# EAGLE design nano (EAGLE 7.6.0)
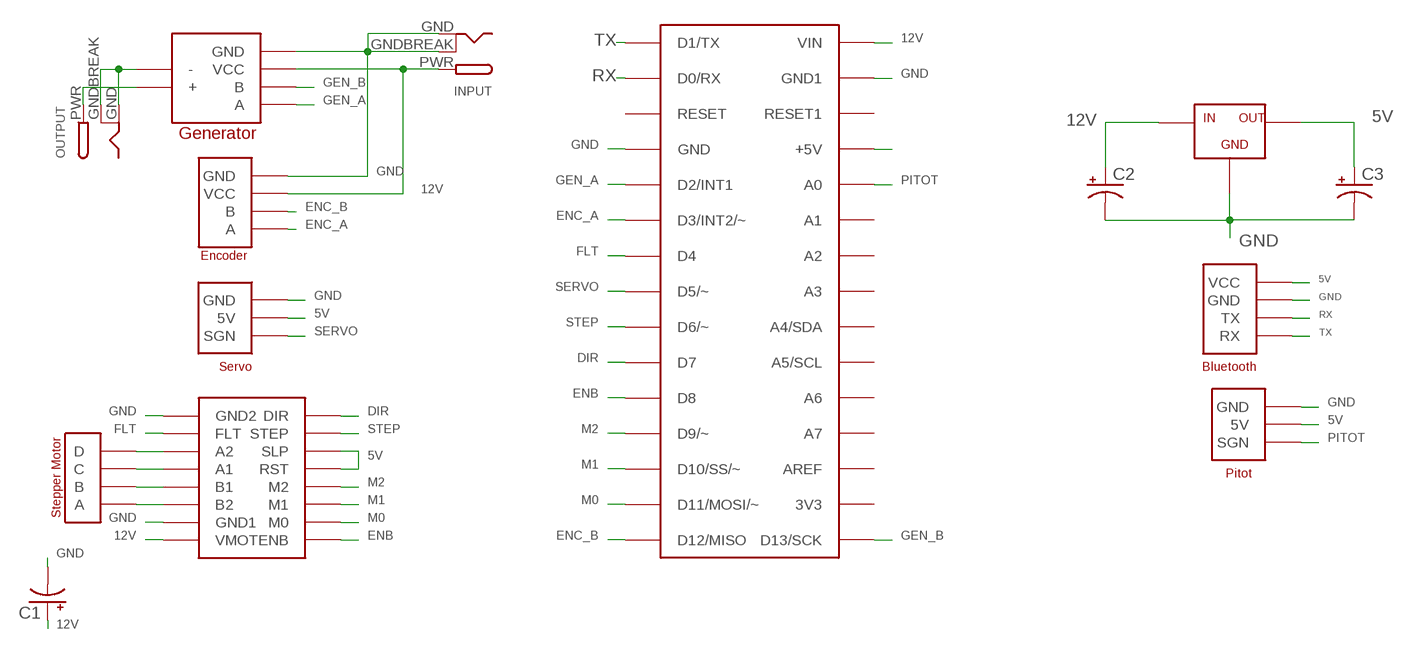
[diagram p0: schematic, sheet 1]

## Parts
C1  100UF-25V-20%(PTH)  [CPOL-RADIAL-100UF-25V]
C2  100UF-25V-20%(PTH)  [CPOL-RADIAL-100UF-25V]
C3  100UF-25V-20%(PTH)  [CPOL-RADIAL-100UF-25V]
INPUT  DCBARRELPTH  [DCJACK_2MM_PTH]
NANO  ARDUINONANO  [PDIP-32]
OUTPUT  DCBARRELPTH  [DCJACK_2MM_PTH]
U$1  HC06  [HC06]
U$2  ENCODER  [ENCODER]
U$3  PITOT  [PITOT]
U$4  STEPPER  [STEPPER]
U$5  STEPPER_DRIVER  [STEPPER_DRIVER]
U$6  SERVO  [SERVO]
U$7  GENERATOR  [GENERATOR]
U$8  7805  [7805]

## Nets
5V: C3.1(+) NANO.+5V U$1.VCC U$3.5V U$5.RST U$5.SLP U$6.5V U$8.OUT
12V: C1.1(+) C2.1(+) INPUT.PWR NANO.VIN U$2.VCC U$5.VMOT U$7.VCC U$8.IN
DIR: NANO.D7 U$5.DIR
ENB: NANO.D8 U$5.ENB
ENC_A: NANO.D3(D3/INT2/~) U$2.A
ENC_B: NANO.D12(D12/MISO) U$2.B
FLT: NANO.D4 U$5.FLT
GEN_A: NANO.D2(D2/INT1) U$7.A
GEN_B: NANO.D13(D13/SCK) U$7.B
GND: C1.2(-) C2.2(-) C3.2(-) INPUT.GND INPUT.GNDBREAK NANO.GND NANO.GND1 OUTPUT.GND OUTPUT.GNDBREAK U$1.GND U$2.GND U$3.GND U$5.GND1(GND2) U$5.GND(GND1) U$6.GND U$7.- U$7.GND U$8.GND
M0: NANO.D11(D11/MOSI/~) U$5.M0
M1: NANO.D10(D10/SS/~) U$5.M1
M2: NANO.D9(D9/~) U$5.M2
N$1: U$4.D U$5.A2
N$2: U$4.C U$5.A1
N$3: U$4.B U$5.B1
N$4: U$4.A U$5.B2
N$7: OUTPUT.PWR U$7.+
PITOT: NANO.A0 U$3.SGN
RX: NANO.D0/RX U$1.TX
SERVO: NANO.D5(D5/~) U$6.SGN
STEP: NANO.D6(D6/~) U$5.STEP
TX: NANO.D1/TX U$1.RX
Unconnected: NANO.3V3 NANO.A1 NANO.A2 NANO.A3 NANO.A4(A4/SDA) NANO.A5(A5/SCL) NANO.A6 NANO.A7 NANO.AREF NANO.RESET NANO.RESET1

## Library data of the parts
C1-C3 = SparkFun-Capacitors:100UF-25V-20%(PTH): CAP-08439; PROD_ID: CAP-08439
INPUT OUTPUT = adafruit:DCBARREL: 2.0mm DC Barrel Jack DCJACK_2MM_PTH - Through Hole Jack (4UConnector: 05537)
NANO = rocketfarm:ARDUINONANO
U$1 = Final_Thesis:HC06
U$2 = Final_Thesis:ENCODER: Encoder connector
U$3 = Final_Thesis:PITOT: Pitot tube connector
U$4 = Final_Thesis:STEPPER: Stepper motor connector
U$5 = Final_Thesis:STEPPER_DRIVER
U$6 = Final_Thesis:SERVO: Servo motor connector
U$7 = Final_Thesis:GENERATOR: Generator connector
U$8 = Final_Thesis:7805

## Board
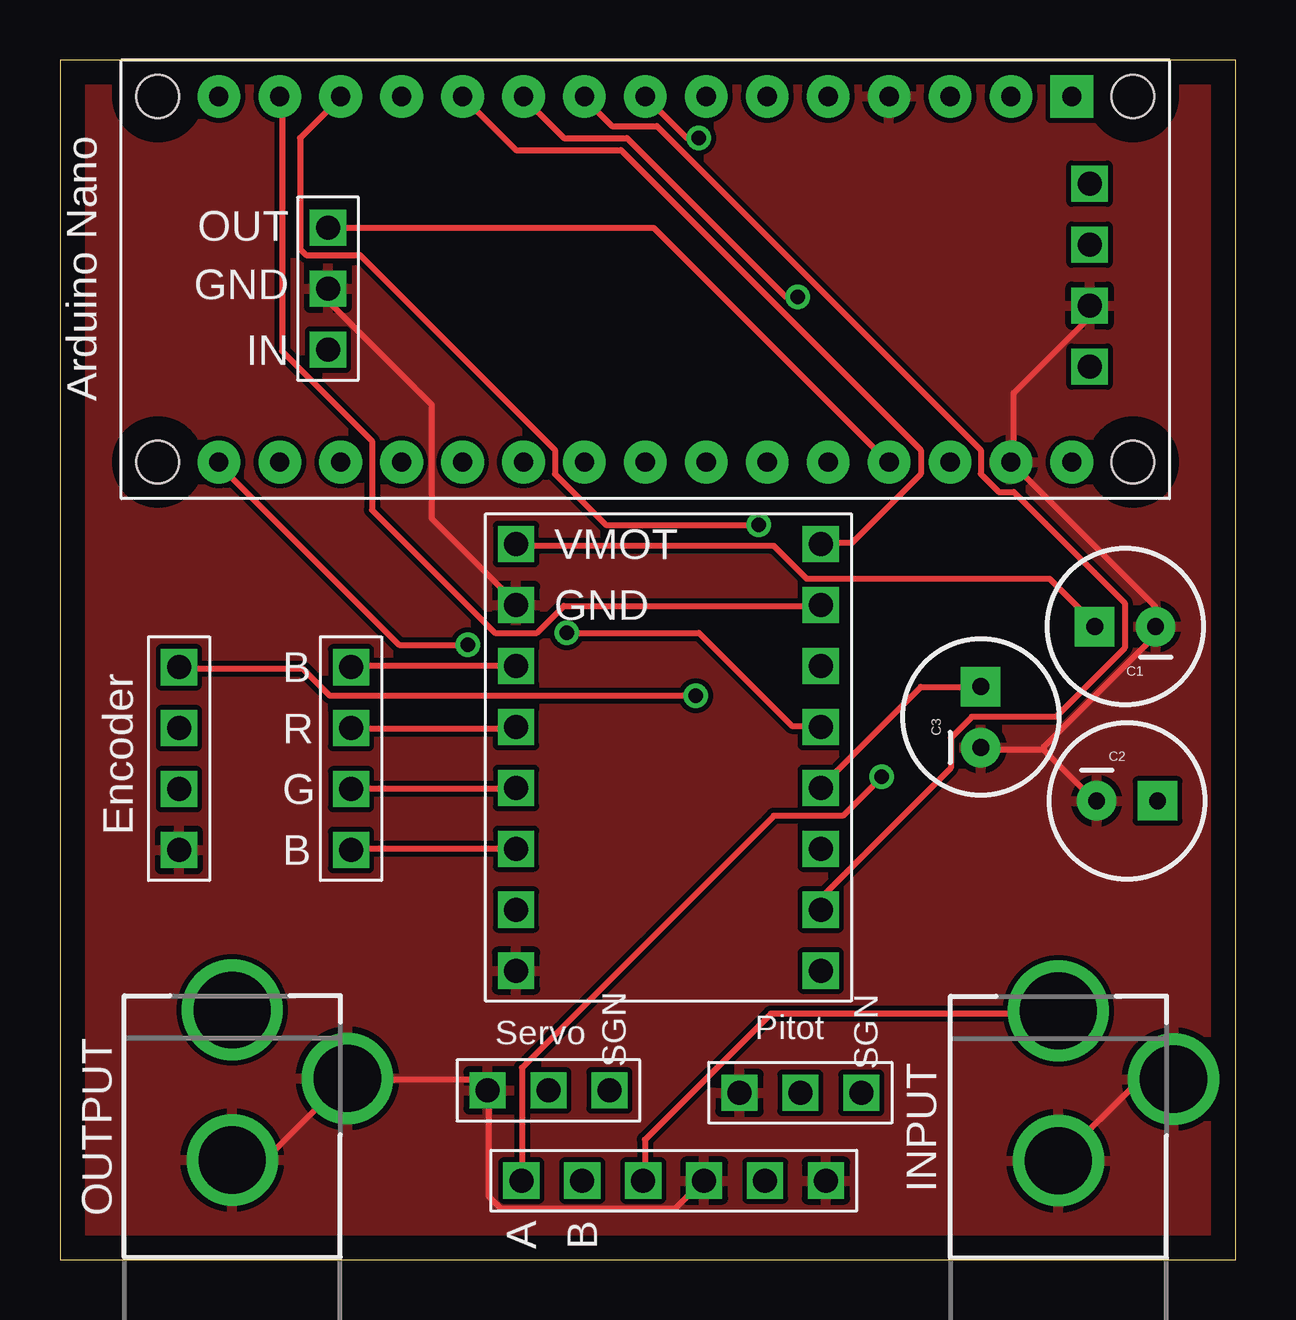
[diagram p1: board, top side]
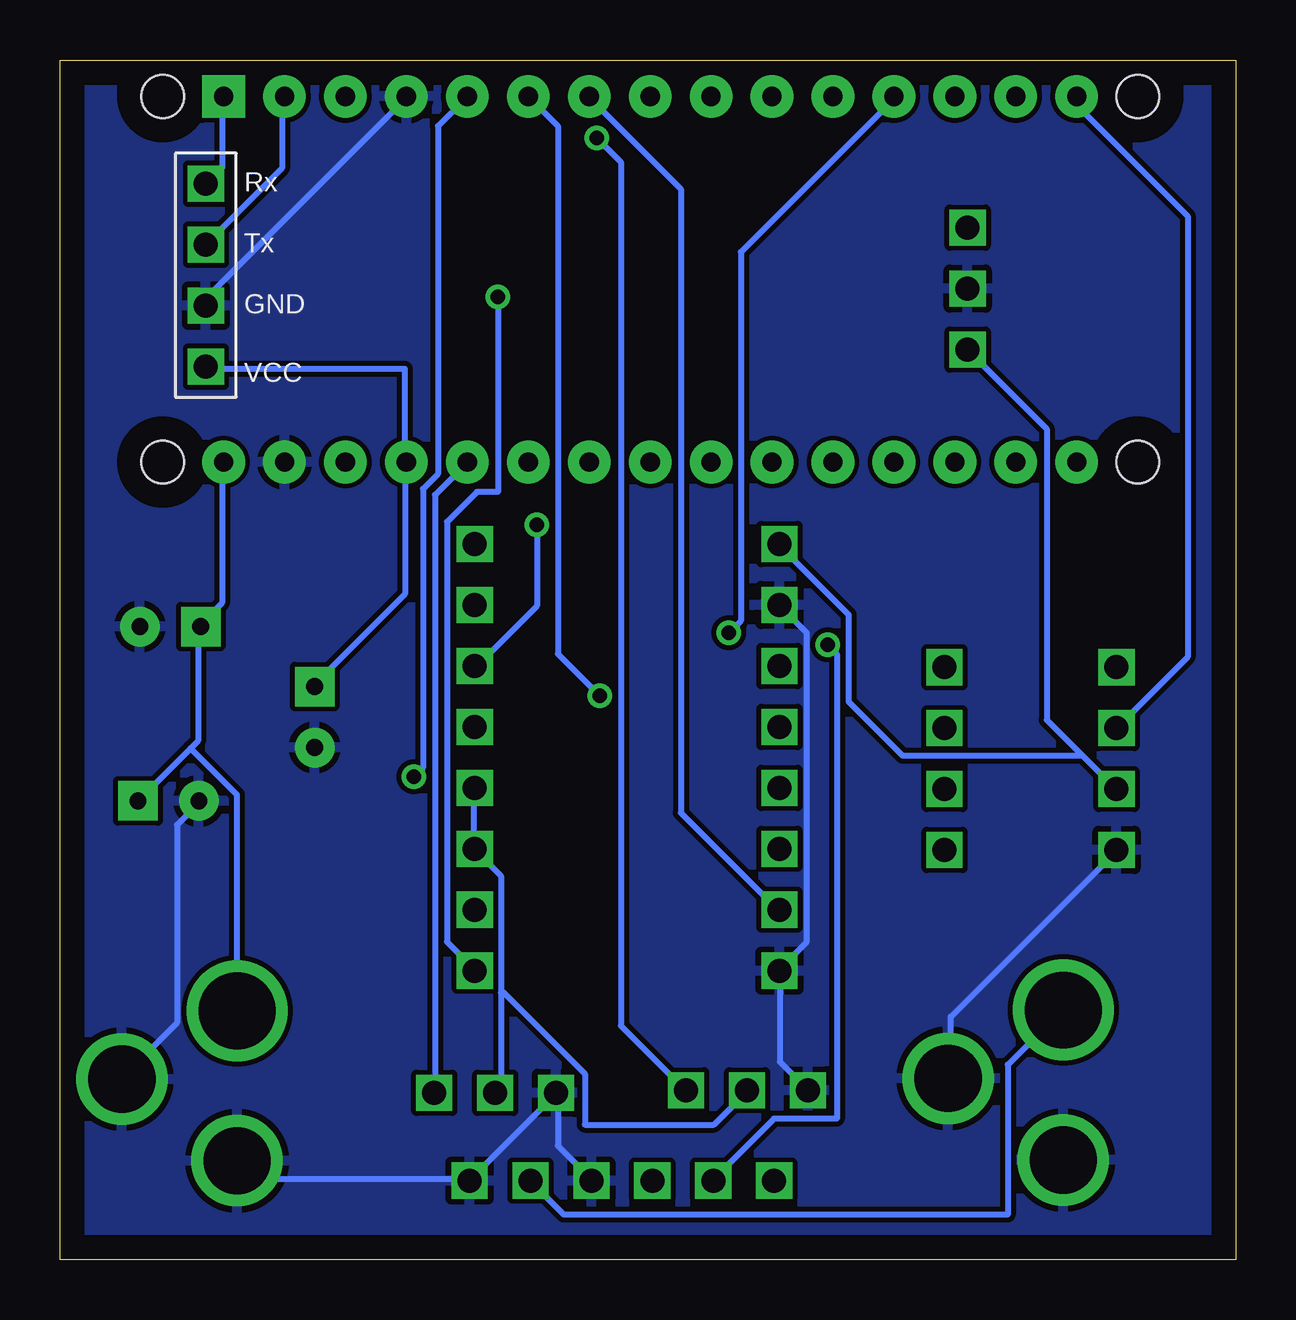
[diagram p2: board, bottom side, seen from below]

Size 49 x 50 mm. Coordinates in mm from the lower left corner, seen from the top.
Outline: 0,0 49,0 49,50 0,50 0,0
Copper layers (1*16): Top 0.035mm / dielectric 1.5mm / Bottom 0.035mm
Design rules "default": minimum track width 10mil, minimum drill 24mil, track to track 8mil, track to pad 8mil, pad to pad 8mil, via to via 8mil, smd to smd 8mil, copper to edge 40mil, drill to drill 8mil, minimum pad ring 10mil, minimum via ring 8mil, stop-mask expansion 4mil, vias tented up to drill 0mil, thermal gap 10mil

### Footprints (pad centres in the part's own frame; a part is rotated, then mirrored left to right if it is on the bottom)
CPOL-RADIAL-100UF-25V = drill 0.7 pad 1.651 square: 1 1.27,0 | drill 0.7 pad 1.651: 2 -1.27,0
DCJACK_2MM_PTH = drill 2.8: GND 0,7.35; GNDBREAK 4.8,10.75 | drill 3.2: PWR 0,13.6
PDIP-32 = drill 0.8 pad 1.778: 3V3 15.24,-35.56; +5V 15.24,-10.16; A0 15.24,-12.7; A1 15.24,-15.24; A2 15.24,-17.78; A3 15.24,-20.32; A4 15.24,-22.86; A5 15.24,-25.4; A6 15.24,-27.94; A7 15.24,-30.48; AREF 15.24,-33.02; D0/RX 0,-5.08; D2 0,-12.7; D3 0,-15.24; D4 0,-17.78; D5 0,-20.32; D6 0,-22.86; D7 0,-25.4; D8 0,-27.94; D9 0,-30.48; D10 0,-33.02; D11 0,-35.56; D12 0,-38.1; D13 15.24,-38.1; GND 0,-10.16; GND1 15.24,-5.08; RESET 0,-7.62; RESET1 15.24,-7.62; VIN 15.24,-2.54 | drill 0.8 pad 1.778 square: D1/TX 0,-2.54 | hole 1.778: 0,0; 0,-40.64; 15.24,-40.64; 15.24,0
HC06 = drill 1 square: GND 1.27,0; RX -3.81,0; TX -1.27,0; VCC 3.81,0
ENCODER = drill 1 square: A 0,3.81; B 0,1.27; GND 0,-3.81; VCC 0,-1.27
PITOT = drill 1 square: 5V 0,-1.27; GND 0,-3.81; SGN 0,1.27
STEPPER = drill 1 square: A 0,3.81; B 0,1.27; C 0,-1.27; D 0,-3.81
STEPPER_DRIVER = drill 1 square: A1 -6.35,-1.27; A2 -6.35,-3.81; B1 -6.35,1.27; B2 -6.35,3.81; DIR 6.35,-8.89; ENB 6.35,8.89; FLT -6.35,-6.35; GND -6.35,-8.89; GND1 -6.35,6.35; M0 6.35,6.35; M1 6.35,3.81; M2 6.35,1.27; RST 6.35,-1.27; SLP 6.35,-3.81; STEP 6.35,-6.35; VMOT -6.35,8.89
SERVO = drill 1 square: 5V 0,-1.27; GND 0,-3.81; SGN 0,1.27
GENERATOR = drill 1 square: + 0,-3.81; - 0,-6.35; A 0,6.35; B 0,3.81; GND 0,-1.27; VCC 0,1.27
7805 = drill 1 square: GND 2.54,-2.54; IN 0,-2.54; OUT 5.08,-2.54

### Placement (x,y rotation side)
C1  44.4,26.38 180 top
C2  44.48,19.12 0 top
C3  38.38,22.61 90 top
INPUT  41.62,-3.23 0 top
NANO  44.72,48.48 270 top
OUTPUT  7.18,-3.2 0 top
U$1  42.92,41.03 270 bottom
U$2  4.96,20.88 0 top
U$3  32.13,6.95 270 top
U$4  12.13,20.88 0 top
U$5  25.36,20.93 0 top
U$6  21.63,7.05 270 top
U$7  25.58,3.29 90 top
U$8  8.63,37.93 90 top

### Tracks (layer width: path | path; a pad name or v marks a point on that pad's centre or on a via)
5V
  Top 0.254: C3.1 35.88,23.88 31.75,19.75 U$5.RST | U$8.OUT 11.25,43 24.75,43 34.5,33.25 NANO.+5V
  Bottom 0.254: 30.62,11.12 30.62,16 31.62,17 U$5.SLP 31.75,17.12 31.75,19.62 U$5.RST | 30.62,11.12 30.62,7.12 30.75,7 U$3.5V | U$6.5V 20.38,7 21.75,5.62 27.12,5.62 27.12,7.75 30.5,11.12 30.62,11.12 | U$1.VCC 42.88,37.12 34.62,37.12 34.62,33.25 NANO.+5V 34.62,33.12 34.62,27.75 38.38,24 C3.1
12V
  Top 0.254: U$7.VCC 24.38,3.38 24.38,5 29.62,10.25 41.5,10.25 INPUT.PWR | U$5.VMOT 19.12,29.75 29.75,29.75 31.12,28.38 41.25,28.38 43.12,26.5 C1.1
  Bottom 0.254: 6.44,21.06 7.88,22.5 7.88,34.62 11.12,37.88 U$8.IN | 6.44,21.06 5,19.62 U$2.VCC | U$5.VMOT 19,29.75 16.12,26.88 16.12,23.25 13.88,21 6.5,21 6.44,21.06 | NANO.VIN 42.25,33.12 42.25,27.38 43.12,26.5 C1.1 43.25,26.38 43.25,21.62 43.56,21.31 | 43.56,21.31 C2.1 | 43.56,21.31 41.62,19.38 INPUT.PWR
DIR  (via drill 0.61)
  Top 0.254: v30.75,40.12 30.25,40.12 23.62,46.75 21,46.75 19.38,48.38 NANO.D7
  Bottom 0.254: v30.75,40.12 30.75,32 31.62,32 32.88,30.75 32.88,13.25 31.75,12.12 U$5.DIR
ENB
  Top 0.254: U$5.ENB 31.75,29.88 33,29.88 35.88,32.75 35.88,33.75 23.38,46.25 19,46.25 16.88,48.38 NANO.D8
ENC_A  (via drill 0.61)
  Top 0.254: v26.5,23.5 11.25,23.5 10.12,24.62 5,24.62 U$2.A
  Bottom 0.254: v26.5,23.5 28.25,25.25 28.25,47.25 NANO.D3
ENC_B
  Bottom 0.254: U$2.B 4.88,22.25 2,25.12 2,43.5 6.5,48 6.5,48.38 NANO.D12
FLT
  Bottom 0.254: U$5.FLT 19.12,14.62 23.12,18.62 23.12,44.62 26.88,48.38 NANO.D4
GEN_A  (via drill 0.61)
  Top 0.254: v34.25,20.12 32.62,18.5 29.75,18.5 19.25,8 19.25,3.38 U$7.A
  Bottom 0.254: v34.25,20.12 33.88,20.5 33.88,32.12 33.25,32.75 33.25,47.25 NANO.D2
GEN_B  (via drill 0.61)
  Top 0.254: v17,25.62 14.12,25.62 6.62,33.12 NANO.D13
  Bottom 0.254: v17,25.62 16.62,25.25 16.62,5.88 19.25,5.88 21.75,3.38 U$7.B
GND
  Top 0.254: OUTPUT.GND 7.25,4.25 8.62,4.25 11.88,7.5 OUTPUT.GNDBREAK 12,7.5 17.38,7.5 17.75,7.12 U$6.GND 17.88,7 17.88,2.62 18.38,2.12 25.62,2.12 26.75,3.25 U$7.GND | U$8.GND 11.25,40.38 11.25,39.88 15.5,35.62 15.5,30.88 19,27.38 U$5.GND1 | INPUT.GND 45,7.5 46.38,7.5 INPUT.GNDBREAK | 41,21.25 38.5,21.25 C3.2 | 41,21.25 43.12,19.12 C2.2 | 41,21.25 41,21.38 45.62,26 45.62,26.38 C1.2 45.62,26.5 45.62,27.25 39.75,33.12 NANO.GND1 39.75,33.25 39.75,36.12 42.88,39.25 42.88,39.75 U$1.GND
  Bottom 0.254: U$2.GND 5,17 11.88,10.12 11.88,7.62 OUTPUT.GNDBREAK | U$6.GND 17.88,7.12 19,8.25 19,12 U$5.GND 19,12.12 17.88,13.25 17.88,26.12 19,27.25 U$5.GND1 | U$7.GND 26.88,3.38 28.25,4.75 28.25,6.88 U$3.GND 28.38,6.88 31.88,3.38 U$7.- 32,3.38 41.5,3.38 41.5,4 INPUT.GND | NANO.GND 34.62,48.38 42.88,40.12 42.88,39.88 U$1.GND | INPUT.GNDBREAK 46.38,7.62 44.12,9.88 44.12,18.12 43.25,19 C2.2
  pour Bottom: -1,50.8 -1,-2.54 49.8,-2.54 49.8,50.8
  pour Top: -1,50.8 -1,-2.54 49.8,-2.54 49.8,50.8
M0
  Top 0.254: U$5.M0 31.62,27.25 21,27.25 19.88,26.12 18.12,26.12 13,31.25 13,34.12 9.25,37.88 9.25,48.38 NANO.D11
M1  (via drill 0.61)
  Top 0.254: v29.12,30.62 22.75,30.62 20.62,32.75 20.62,33.75 12.5,41.88 10.25,41.88 10,42.12 10,46.75 11.62,48.38 NANO.D10
  Bottom 0.254: v29.12,30.62 29.12,27.25 31.62,24.75 U$5.M1
M2  (via drill 0.61)
  Top 0.254: v21.12,26.12 26.62,26.12 30.5,22.25 31.62,22.25 U$5.M2
  Bottom 0.254: v21.12,26.12 20.62,26.62 20.62,42 14.25,48.38 NANO.D9
N$1
  Top 0.254: U$4.D 12.25,17.12 U$5.A2
N$2
  Top 0.254: U$4.C 12.25,19.62 19,19.62 U$5.A1
N$3
  Top 0.254: U$4.B 12.25,22.12 19,22.12 U$5.B1
N$4
  Top 0.254: U$4.A 12.25,24.75 U$5.B2
N$7
  Bottom 0.254: U$7.+ 29.38,3.25 28,1.88 9.5,1.88 9.5,8.12 7.25,10.38 OUTPUT.PWR
PITOT
  Bottom 0.254: U$3.SGN 33.38,7 33.38,31.88 32.12,33.12 NANO.A0
RX
  Bottom 0.254: U$1.TX 42.88,42.38 39.75,45.5 39.75,48.38 NANO.D0/RX
SERVO  (via drill 0.61)
  Top 0.254: v26.62,46.75 26.12,46.75 24.5,48.38 NANO.D5
  Bottom 0.254: v26.62,46.75 25.62,45.75 25.62,9.75 23,7.12 U$6.SGN
STEP
  Top 0.254: U$5.STEP 31.75,14.62 31.75,15.12 37.12,20.5 37.12,21.75 38,22.62 41.5,22.62 44.38,25.5 44.38,27.38 39.75,32 39.12,32 38.38,32.75 38.38,33.75 24.88,47.25 23,47.25 21.88,48.38 NANO.D6
TX
  Bottom 0.254: U$1.RX 42.88,44.88 42.25,45.5 42.25,48.38 NANO.D1/TX